# Altium schematic sheet Microcontroller.SchDoc
size A
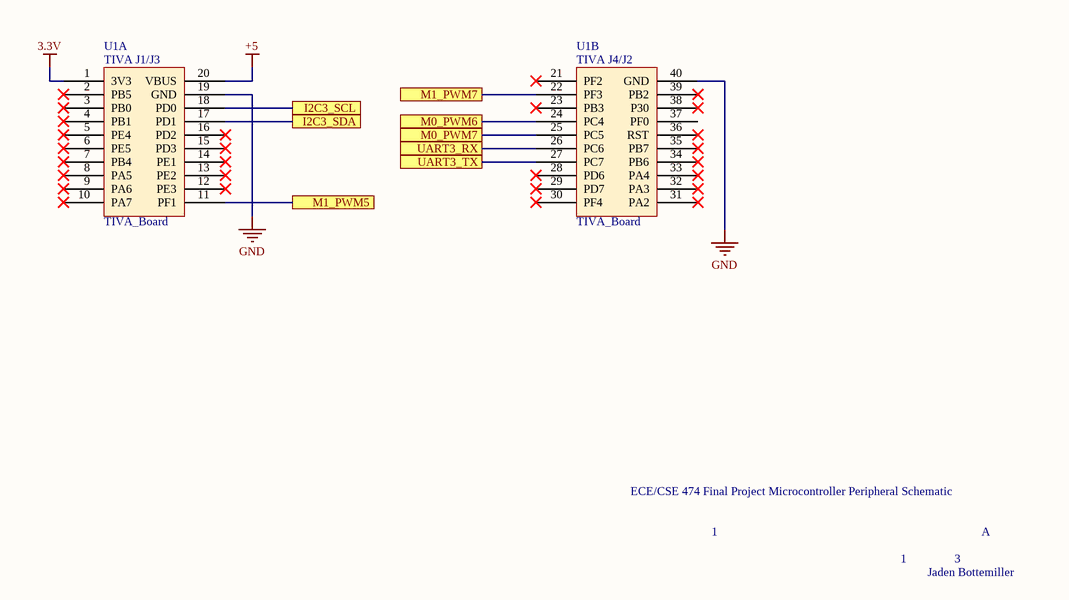
[diagram p0: Microcontroller.SchDoc]

## Parts
U1  TIVA_Board  [TIVA_AB]  (parts A,B of 2)

## Ports
I2C3_SCL, I2C3_SDA, M0_PWM6, M0_PWM7, M1_PWM5, M1_PWM7, UART3_RX, UART3_TX

## Nets
3.3V: U1.1(3V3)
+5: U1.20(VBUS)
GND: U1.19(GND) U1.40(GND)
I2C3_SCL: U1.18(PD0) ; port I2C3_SCL
I2C3_SDA: U1.17(PD1) ; port I2C3_SDA
M0_PWM6: U1.24(PC4) ; port M0_PWM6
M0_PWM7: U1.25(PC5) ; port M0_PWM7
M1_PWM5: U1.11(PF1) ; port M1_PWM5
M1_PWM7: U1.22(PF3) ; port M1_PWM7
UART3_RX: U1.26(PC6) ; port UART3_RX
UART3_TX: U1.27(PC7) ; port UART3_TX

Not connected (* = marked no-connect by the designer): U1 2(PB5)* 3(PB0)* 4(PB1)* 5(PE4)* 6(PE5)* 7(PB4)* 8(PA5)* 9(PA6)* 10(PA7)* 12(PE3)* 13(PE2)* 14(PE1)* 15(PD3)* 16(PD2)* 21(PF2)* 23(PB3)* 28(PD6)* 29(PD7)* 30(PF4)* 31(PA2)* 32(PA3)* 33(PA4)* 34(PB6)* 35(PB7)* 36(RST)* 37(PF0) 38(P30)* 39(PB2)*

## Notes on the sheet
- ECE/CSE 474 Final Project Microcontroller Peripheral Schematic
- 1
- 3
- A
- Jaden Bottemiller
- (in symbol TIVA_Board, part A) TIVA J1/J3
- (in symbol TIVA_Board, part B) TIVA J4/J2